# Altium project RelayVolumeControl.PrjPcb
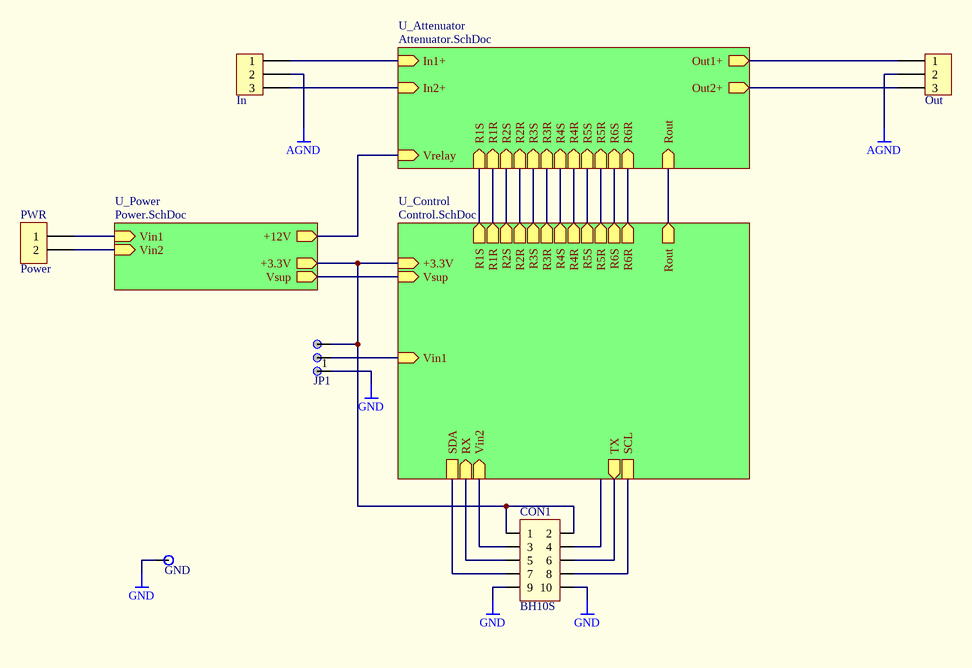
[diagram p0: Main.SchDoc]
4 sheets, 85 parts. Net scope: hierarchical (ports join the sheet entries above them; power ports are global).
Board file: VolumeAttenuator.PcbDoc
Sheets:
  Main.SchDoc
    U_Attenuator = Attenuator.SchDoc
    U_Control = Control.SchDoc
    U_Power = Power.SchDoc

## Sheet Main.SchDoc: Molniya Relay Attenuator
size A4; DrawnBy: I.Vasilev

### Parts
CON1  BH10S  [BH10S]
GND  TESTPAD  [MISC_PAD-36/65]  (value not drawn)
In  CON3  [CON_WS03S]  (value not drawn)
JP1  Jumper, 3pin  [JP3]  (value not drawn)
Out  CON3  [CON_WS03S]  (value not drawn)
PWR  Power  [CONN_TOP_2P]

### Sub-sheets
U_Attenuator = Attenuator.SchDoc: Vrelay (in), R1S (in), R1R (in), R2S (in), R2R (in), R3S (in), R3R (in), R4S (in), R4R (in), R5S (in), R5R (in), R6S (in), R6R (in), In1+ (in), In2+ (in), Out1+ (out), Out2+ (out), Rout (in)
U_Control = Control.SchDoc: R1S (out), R1R (out), R2S (out), R2R (out), R3S (out), R3R (out), R4S (out), R4R (out), R5S (out), R5R (out), R6S (out), R6R (out), SDA, SCL, Vsup (in), Rout (out), TX (out), RX (in), +3.3V (in), Vin1 (in), Vin2 (in)
U_Power = Power.SchDoc: Vin1 (in), Vin2 (in), +12V (out), +3.3V (out), Vsup (out)

### Nets
3.3V: CON1.1 CON1.2 JP1.3 ; sheet U_Control/+3.3V, sheet U_Power/+3.3V
AGND: In.2 Out.2
GND: CON1.9 CON1.10 GND.1 JP1.1
R1R: sheet U_Attenuator/R1R, sheet U_Control/R1R
R1S: sheet U_Attenuator/R1S, sheet U_Control/R1S
R2R: sheet U_Attenuator/R2R, sheet U_Control/R2R
R2S: sheet U_Attenuator/R2S, sheet U_Control/R2S
R3R: sheet U_Attenuator/R3R, sheet U_Control/R3R
R3S: sheet U_Attenuator/R3S, sheet U_Control/R3S
R4R: sheet U_Attenuator/R4R, sheet U_Control/R4R
R4S: sheet U_Attenuator/R4S, sheet U_Control/R4S
R5R: sheet U_Attenuator/R5R, sheet U_Control/R5R
R5S: sheet U_Attenuator/R5S, sheet U_Control/R5S
R6R: sheet U_Attenuator/R6R, sheet U_Control/R6R
R6S: sheet U_Attenuator/R6S, sheet U_Control/R6S
Rout: sheet U_Attenuator/Rout, sheet U_Control/Rout
RX: CON1.5 ; sheet U_Control/RX
SCL: CON1.8 ; sheet U_Control/SCL
SDA: CON1.7 ; sheet U_Control/SDA
TX: CON1.6 ; sheet U_Control/TX
NetC4_1: sheet U_Attenuator/Vrelay, sheet U_Power/+12V
NetCON1_3: CON1.3 ; sheet U_Control/Vin2
NetD3_1: sheet U_Control/Vsup, sheet U_Power/Vsup
NetD4_1: PWR.1 ; sheet U_Power/Vin1
NetD4_2: PWR.2 ; sheet U_Power/Vin2
NetIn_1: In.1 ; sheet U_Attenuator/In1+
NetIn_3: In.3 ; sheet U_Attenuator/In2+
NetJP1_2: JP1.2 ; sheet U_Control/Vin1
NetOut_1: Out.1 ; sheet U_Attenuator/Out1+
NetOut_3: Out.3 ; sheet U_Attenuator/Out2+

Not connected (* = marked no-connect by the designer): CON1 4

### Library data of the parts
CON1 = CON2x5: BH10S-side mounted
In Out = CON3: Connector
JP1 = JP3
PWR = CON2: Connector

## Sheet Attenuator.SchDoc
size A4
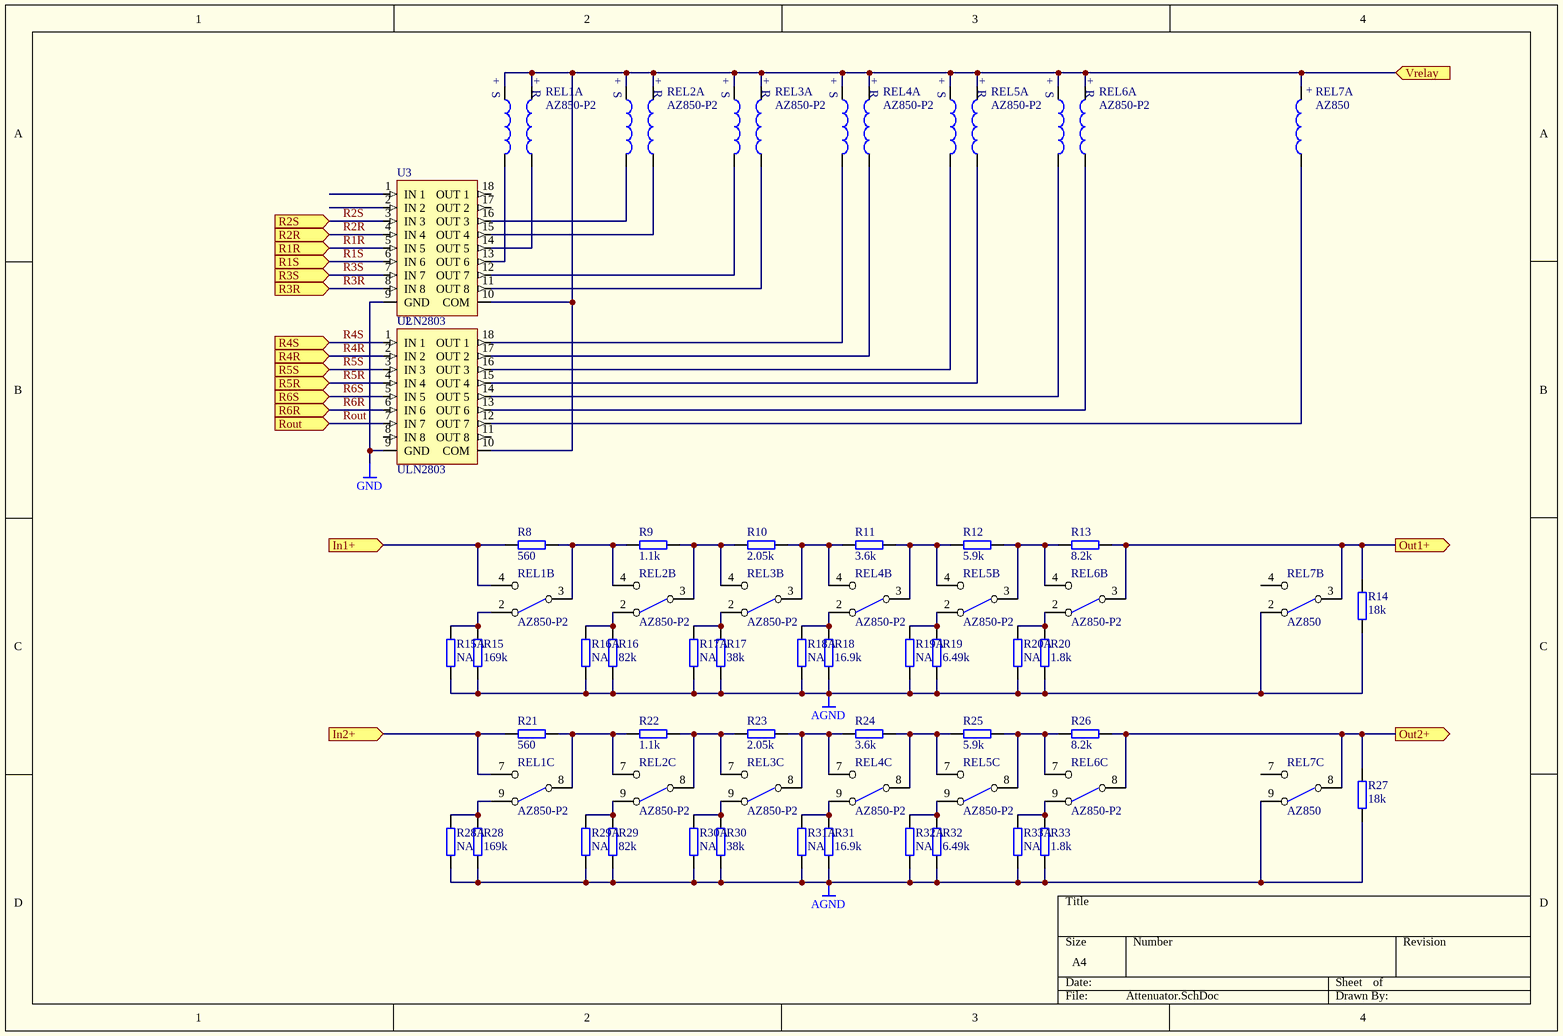
[diagram p1: Attenuator.SchDoc]

### Parts
(Parts that share a designator on the sheet are numbered #1, #2 ... from top to bottom, then left to right.)
R8  560  [R400_1]
R9  1.1k  [R400_1]
R10  2.05k  [R400_1]
R11  3.6k  [R400_1]
R12  5.9k  [R400_1]
R13  8.2k  [R400_1]
R14  18k  [R400_1]
R15  169k  [R400_1]
R15A  NA  [R400_1]
R16  82k  [R400_1]
R16A  NA  [R400_1]
R17  38k  [R400_1]
R17A  NA  [R400_1]
R18  16.9k  [R400_1]
R18A  NA  [R400_1]
R19  6.49k  [R400_1]
R19A  NA  [R400_1]
R20  1.8k  [R400_1]
R20A  NA  [R400_1]
R21  560  [R400_1]
R22  1.1k  [R400_1]
R23  2.05k  [R400_1]
R24  3.6k  [R400_1]
R25  5.9k  [R400_1]
R26  8.2k  [R400_1]
R27  18k  [R400_1]
R28  169k  [R400_1]
R28A  NA  [R400_1]
R29  82k  [R400_1]
R29A  NA  [R400_1]
R30  38k  [R400_1]
R30A  NA  [R400_1]
R31  16.9k  [R400_1]
R31A  NA  [R400_1]
R32  6.49k  [R400_1]
R32A  NA  [R400_1]
R33  1.8k  [R400_1]
R33A  NA  [R400_1]
REL1#1  AZ850-P2  [RELAY_AZ850]  (part A of 3)
REL1#2  AZ850-P2  [RELAY_AZ850]  (parts B,C of 3)
REL2#1  AZ850-P2  [RELAY_AZ850]  (part A of 3)
REL2#2  AZ850-P2  [RELAY_AZ850]  (parts B,C of 3)
REL3#1  AZ850-P2  [RELAY_AZ850]  (part A of 3)
REL3#2  AZ850-P2  [RELAY_AZ850]  (parts B,C of 3)
REL4#1  AZ850-P2  [RELAY_AZ850]  (part A of 3)
REL4#2  AZ850-P2  [RELAY_AZ850]  (parts B,C of 3)
REL5#1  AZ850-P2  [RELAY_AZ850]  (part A of 3)
REL5#2  AZ850-P2  [RELAY_AZ850]  (parts B,C of 3)
REL6#1  AZ850-P2  [RELAY_AZ850]  (part A of 3)
REL6#2  AZ850-P2  [RELAY_AZ850]  (parts B,C of 3)
REL7  AZ850  [RELAY_AZ850]  (parts A,B,C of 3)
U2  ULN2803  [SOIC-18]
U3  ULN2803  [SOIC-18]

### Ports
In1+ (in), In2+ (in), Out1+ (out), Out2+ (out), R1R (in), R1S (in), R2R (in), R2S (in), R3R (in), R3S (in), R4R (in), R4S (in), R5R (in), R5S (in), R6R (in), R6S (in), Rout (in), Vrelay (in)

### Nets
AGND: R14.1 R15.1 R15A.1 R16.1 R16A.1 R17.1 R17A.1 R18.1 R18A.1 R19.1 R19A.1 R20.1 R20A.1 R27.1 R28.1 R28A.1 R29.1 R29A.1 R30.1 R30A.1 R31.1 R31A.1 R32.1 R32A.1 R33.1 R33A.1 REL7.2 REL7.9
GND: U2.9(GND) U3.9(GND)
R1R: U3.5(IN_5) ; port R1R
R1S: U3.6(IN_6) ; port R1S
R2R: U3.4(IN_4) ; port R2R
R2S: U3.3(IN_3) ; port R2S
R3R: U3.8(IN_8) ; port R3R
R3S: U3.7(IN_7) ; port R3S
R4R: U2.2(IN_2) ; port R4R
R4S: U2.1(IN_1) ; port R4S
R5R: U2.4(IN_4) ; port R5R
R5S: U2.3(IN_3) ; port R5S
R6R: U2.6(IN_6) ; port R6R
R6S: U2.5(IN_5) ; port R6S
Rout: U2.7(IN_7) ; port Rout
NetC4_1: REL1#1.1 REL1#1.10 REL2#1.1 REL2#1.10 REL3#1.1 REL3#1.10 REL4#1.1 REL4#1.10 REL5#1.1 REL5#1.10 REL6#1.1 REL6#1.10 REL7.1 U2.10(COM) U3.10(COM) ; port Vrelay
NetIn_1: R8.1 REL1#2.4 ; port In1+
NetIn_3: R21.1 REL1#2.7 ; port In2+
NetOut_1: R13.2 R14.2 REL6#2.3 REL7.3 ; port Out1+
NetOut_3: R26.2 R27.2 REL6#2.8 REL7.8 ; port Out2+
NetR8_2: R8.2 R9.1 REL1#2.3 REL2#2.4
NetR9_2: R9.2 R10.1 REL2#2.3 REL3#2.4
NetR10_2: R10.2 R11.1 REL3#2.3 REL4#2.4
NetR11_2: R11.2 R12.1 REL4#2.3 REL5#2.4
NetR12_2: R12.2 R13.1 REL5#2.3 REL6#2.4
NetR15_2: R15.2 R15A.2 REL1#2.2
NetR16_2: R16.2 R16A.2 REL2#2.2
NetR17_2: R17.2 R17A.2 REL3#2.2
NetR18_2: R18.2 R18A.2 REL4#2.2
NetR19_2: R19.2 R19A.2 REL5#2.2
NetR20_2: R20.2 R20A.2 REL6#2.2
NetR21_2: R21.2 R22.1 REL1#2.8 REL2#2.7
NetR22_2: R22.2 R23.1 REL2#2.8 REL3#2.7
NetR23_2: R23.2 R24.1 REL3#2.8 REL4#2.7
NetR24_2: R24.2 R25.1 REL4#2.8 REL5#2.7
NetR25_2: R25.2 R26.1 REL5#2.8 REL6#2.7
NetR28_2: R28.2 R28A.2 REL1#2.9
NetR29_2: R29.2 R29A.2 REL2#2.9
NetR30_2: R30.2 R30A.2 REL3#2.9
NetR31_2: R31.2 R31A.2 REL4#2.9
NetR32_2: R32.2 R32A.2 REL5#2.9
NetR33_2: R33.2 R33A.2 REL6#2.9
NetREL1#1_5: REL1#1.5 U3.13(OUT_6)
NetREL1#1_6: REL1#1.6 U3.14(OUT_5)
NetREL2#1_5: REL2#1.5 U3.16(OUT_3)
NetREL2#1_6: REL2#1.6 U3.15(OUT_4)
NetREL3#1_5: REL3#1.5 U3.12(OUT_7)
NetREL3#1_6: REL3#1.6 U3.11(OUT_8)
NetREL4#1_5: REL4#1.5 U2.18(OUT_1)
NetREL4#1_6: REL4#1.6 U2.17(OUT_2)
NetREL5#1_5: REL5#1.5 U2.16(OUT_3)
NetREL5#1_6: REL5#1.6 U2.15(OUT_4)
NetREL6#1_5: REL6#1.5 U2.14(OUT_5)
NetREL6#1_6: REL6#1.6 U2.13(OUT_6)
NetREL7_10: REL7.10 U2.12(OUT_7)

Not connected (* = marked no-connect by the designer): REL7 4 7; U2 8(IN_8) 11(OUT_8); U3 1(IN_1) 2(IN_2) 17(OUT_2) 18(OUT_1)

### Notes on the sheet
- (in symbol AZ850, part A) +; S; R

### Library data of the parts
R8-R15 R15A R16 R16A R17 R17A R18 R18A R19 R19A R20 R20A R21-R28 R28A R29 R29A R30 R30A R31 R31A R32 R32A R33 R33A = RES: Resistor
REL1#1 REL2#1 REL3#1 REL4#1 REL5#1 REL6#1 REL7 = AZ850: bi-stable relay
REL1#2 REL2#2 REL3#2 REL4#2 REL5#2 REL6#2 = AZ850-P2: bi-stable relay
U2 U3 = ULN2803: HIGH-VOLTAGE,HIGH-CURRENT DARLINTON ARRAYS

## Sheet Control.SchDoc
size A4
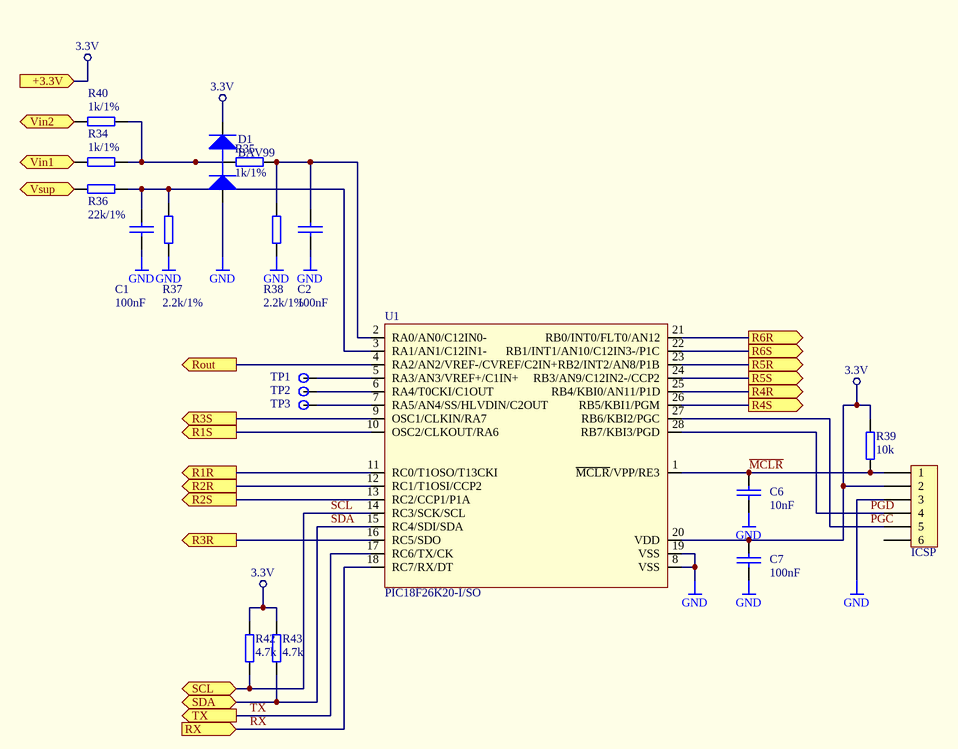
[diagram p2: Control.SchDoc]

### Parts
C1  100nF  [0805_1]
C2  100nF  [0805_1]
C6  10nF  [0805_1]
C7  100nF  [0805_1]
D1  BAV99  [SOT-23]
ICSP  CON6  [JP6]  (value not drawn)
R34  1k/1%  [0805_1]
R35  1k/1%  [0805_1]
R36  22k/1%  [0805_1]
R37  2.2k/1%  [0805_1]
R38  2.2k/1%  [0805_1]
R39  10k  [0805_1]
R40  1k/1%  [0805_1]
R42  4.7k  [0805_1]
R43  4.7k  [0805_1]
TP1  TESTPAD  [PAD-36/65]  (value not drawn)
TP2  TESTPAD  [PAD-36/65]  (value not drawn)
TP3  TESTPAD  [PAD-36/65]  (value not drawn)
U1  PIC18F26K20-I/SO  [SOIC-28]

### Ports
+3.3V (in), R1R (out), R1S (out), R2R (out), R2S (out), R3R (out), R3S (out), R4R (out), R4S (out), R5R (out), R5S (out), R6R (out), R6S (out), Rout (out), RX (in), SCL, SDA, TX (out), Vin1 (in), Vin2 (in), Vsup (in)

### Nets
3.3V: C7.1 D1.2(K) ICSP.2 R39.2 R42.2 R43.2 U1.20(VDD) ; port +3.3V
GND: C1.2 C2.2 C6.2 C7.2 D1.1(A) ICSP.3 R37.1 R38.1 U1.8(VSS) U1.19(VSS)
~{MCLR}: C6.1 ICSP.1 R39.1 U1.1(~{MCLR}/VPP/RE3)
PGC: ICSP.5 U1.27(RB6/KBI2/PGC)
PGD: ICSP.4 U1.28(RB7/KBI3/PGD)
R1R: U1.11(RC0/T1OSO/T13CKI) ; port R1R
R1S: U1.10(OSC2/CLKOUT/RA6) ; port R1S
R2R: U1.12(RC1/T1OSI/CCP2) ; port R2R
R2S: U1.13(RC2/CCP1/P1A) ; port R2S
R3R: U1.16(RC5/SDO) ; port R3R
R3S: U1.9(OSC1/CLKIN/RA7) ; port R3S
R4R: U1.25(RB4/KBI0/AN11/P1D) ; port R4R
R4S: U1.26(RB5/KBI1/PGM) ; port R4S
R5R: U1.23(RB2/INT2/AN8/P1B) ; port R5R
R5S: U1.24(RB3/AN9/C12IN2-/CCP2) ; port R5S
R6R: U1.21(RB0/INT0/FLT0/AN12) ; port R6R
R6S: U1.22(RB1/INT1/AN10/C12IN3-/P1C) ; port R6S
Rout: U1.4(RA2/AN2/VREF-/CVREF/C2IN+) ; port Rout
RX: U1.18(RC7/RX/DT) ; port RX
SCL: R42.1 U1.14(RC3/SCK/SCL) ; port SCL
SDA: R43.1 U1.15(RC4/SDI/SDA) ; port SDA
TX: U1.17(RC6/TX/CK) ; port TX
NetC1_1: C1.1 R36.1 R37.2 U1.3(RA1/AN1/C12IN1-)
NetC2_1: C2.1 R35.1 R38.2 U1.2(RA0/AN0/C12IN0-)
NetCON1_3: R40.2 ; port Vin2
NetD1_3: D1.3(C) R34.1 R35.2 R40.1
NetD3_1: R36.2 ; port Vsup
NetJP1_2: R34.2 ; port Vin1
NetTP1_1: TP1.1 U1.5(RA3/AN3/VREF+/C1IN+)
NetTP2_1: TP2.1 U1.6(RA4/T0CKI/C1OUT)
NetTP3_1: TP3.1 U1.7(RA5/AN4/SS/HLVDIN/C2OUT)

Not connected (* = marked no-connect by the designer): ICSP 6

### Library data of the parts
C1 C2 C6 C7 = CAP: Capacitor
D1 = BAV99: SOT23 Silicon Planar High-Speed Switching Series Diode Pair; Manufacturer: Zetex; Class: Discrete; SubClass: Diode - Switching; Published: 8/06/2000; Publisher: Altium Hobart Technology Centre
ICSP = CON6: Connector
R34-R40 R42 R43 = RES: Resistor
U1 = PIC18F26K20-I/SO: PIC18 mid-range mcu

## Sheet Power.SchDoc
size A4
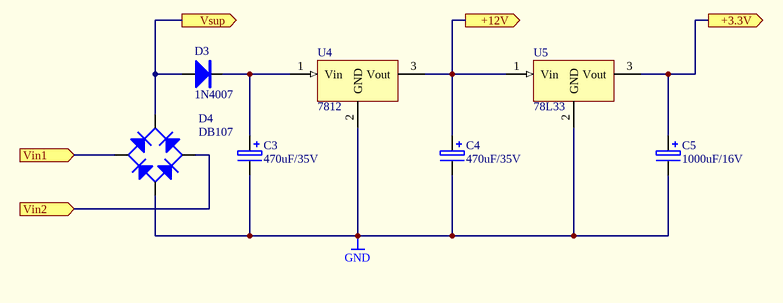
[diagram p3: Power.SchDoc]

### Parts
C3  470uF/35V  [EC10x20]
C4  470uF/35V  [EC8x16]
C5  1000uF/16V  [EC6.3x12]
D3  1N4007  [R400_V]
D4  DB107  [BRIDGE_PTH]
U4  7812  [TO-220-V]
U5  78L33  [IC_TO-92]

### Ports
+3.3V (out), +12V (out), Vin1 (in), Vin2 (in), Vsup (out)

### Nets
3.3V: C5.1 U5.3(Vout) ; port +3.3V
GND: C3.2 C4.2 C5.2 D4.4(M) U4.2(GND) U5.2(GND)
NetC3_1: C3.1 D3.2(K) U4.1(Vin)
NetC4_1: C4.1 U4.3(Vout) U5.1(Vin) ; port +12V
NetD3_1: D3.1(A) D4.3(P) ; port Vsup
NetD4_1: D4.1(AC1) ; port Vin1
NetD4_2: D4.2(AC2) ; port Vin2

### Library data of the parts
C3-C5 = ELECTRO1: Electrolytic Capacitor
D3 = DIODE
D4 = BRIDGE
U4 U5 = 78XX

## Nets that join several sheets
3.3V: Main (CON1.1 CON1.2 JP1.3), Control (7 pins), Power (C5.1 U5.3)
AGND: Main (In.2 Out.2), Attenuator (28 pins)
GND: Main (CON1.9 CON1.10 GND.1 JP1.1), Attenuator (U2.9 U3.9), Control (10 pins), Power (6 pins)
NetC4_1: Attenuator (15 pins), Power (C4.1 U4.3 U5.1)
NetCON1_3: Main (CON1.3), Control (R40.2)
NetD3_1: Control (R36.2), Power (D3.1 D4.3)
NetD4_1: Main (PWR.1), Power (D4.1)
NetD4_2: Main (PWR.2), Power (D4.2)
NetIn_1: Main (In.1), Attenuator (R8.1 REL1#2.4)
NetIn_3: Main (In.3), Attenuator (R21.1 REL1#2.7)
NetJP1_2: Main (JP1.2), Control (R34.2)
NetOut_1: Main (Out.1), Attenuator (R13.2 R14.2 REL6#2.3 REL7.3)
NetOut_3: Main (Out.3), Attenuator (R26.2 R27.2 REL6#2.8 REL7.8)
R1R: Attenuator (U3.5), Control (U1.11)
R1S: Attenuator (U3.6), Control (U1.10)
R2R: Attenuator (U3.4), Control (U1.12)
R2S: Attenuator (U3.3), Control (U1.13)
R3R: Attenuator (U3.8), Control (U1.16)
R3S: Attenuator (U3.7), Control (U1.9)
R4R: Attenuator (U2.2), Control (U1.25)
R4S: Attenuator (U2.1), Control (U1.26)
R5R: Attenuator (U2.4), Control (U1.23)
R5S: Attenuator (U2.3), Control (U1.24)
R6R: Attenuator (U2.6), Control (U1.21)
R6S: Attenuator (U2.5), Control (U1.22)
Rout: Attenuator (U2.7), Control (U1.4)
RX: Main (CON1.5), Control (U1.18)
SCL: Main (CON1.8), Control (R42.1 U1.14)
SDA: Main (CON1.7), Control (R43.1 U1.15)
TX: Main (CON1.6), Control (U1.17)